# Altium schematic sheet LORA_Sheet1.SchDoc
size A4; SheetNumber: 5; SheetTotal: 11
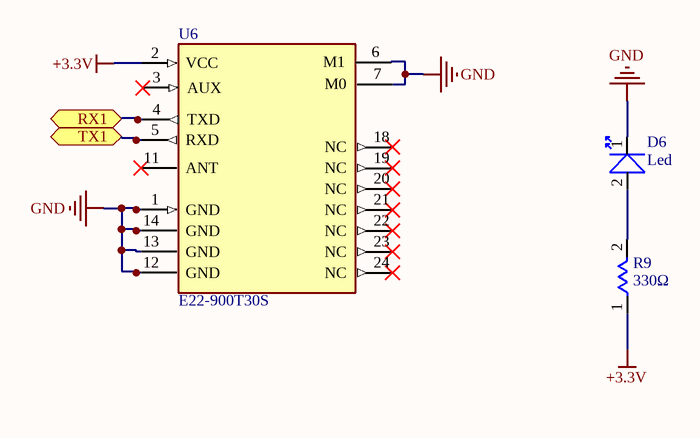
[diagram p0: LORA_Sheet1.SchDoc]

## Parts
D6  Led  [LED - 0603]
R9  330Ω  [RES - 0603]
U6  E22-900T30S  [E220-400T30S]

## Ports
RX1 (bidir), TX1 (bidir)

## Nets
+3.3V: R9.1 U6.2(VCC)
GND: D6.1 U6.1(GND) U6.6(M1) U6.7(M0) U6.12(GND) U6.13(GND) U6.14(GND)
RX1: U6.4(TXD) ; port RX1
TX1: U6.5(RXD) ; port TX1
NetD6_2: D6.2 R9.2

Not connected (* = marked no-connect by the designer): U6 3(AUX)* 11(ANT)* 18(NC)* 19(NC)* 20(NC)* 21(NC)* 22(NC)* 23(NC)* 24(NC)*

## Library data of the parts
D6 = Led: HL-PST-1608U51GC - LED SMD 0603 GREEN 500mcd 120° WATER CLEAR; ComponentLink1Description: Satın Alma Linki; ComponentLink1URL: https://ozdisan.com/Product/Detail/471660/HL-PST-1608U51GC; ComponentLink2Description: Datasheet; ComponentLink2URL: https://cdn.ozdisan.com/ETicaret_Dosya/471660_7204356.pdf
R9 = Res: SMD Res; ComponentLink1Description: Datasheet; ComponentLink1URL: https://cdn.ozdisan.com/ETicaret_Dosya/570122_9878629.pdf; ComponentLink2Description: Satın Alma Linki; ComponentLink2URL: https://www.ozdisan.com/pasif-komponentler/direncler/smt-smd-direncler/TC0325B3301T5C; ComponentLink3Description: Satın Alma Linki; ComponentLink3URL: https://ozdisan.com/pasif-komponentler/direncler/smt-smd-ve-cip-direncler/0603SAF4701T5E; ComponentLink4Description: Satın Alma Linki; ComponentLink4URL: https://ozdisan.com/pasif-komponentler/direncler/smt-smd-ve-cip-direncler/0805S8F604JT5E; ComponentLink5Description: Satın Alma Linki; ComponentLink5URL: https://ozdisan.com/pasif-komponentler/direncler/smt-smd-ve-cip-direncler/0603SAF1022T5E; ComponentLink6Description: Satın Alma Linki; ComponentLink6URL: https://www.ozdisan.com/pasif-komponentler/direncler/smt-smd-direncler/CQ03SAF0000T5E
U6 = E22-900T30S: E22-900T30S is a wireless serial port module _UART_ based on SEMTECH's SX1262 RF chip.; MF: EBYTE; MP: E22-900T30S; Package: Package Analog Devices; Price: None; Value: *; SnapEDA_Link: https://www.snapeda.com/parts/E22-900T30S/EBYTE/view-part/3611926/?ref=snap; Availability: Unavailable; ComponentLink1Description: Satın Alma L,nk,; ComponentLink1URL: https://www.f1depo.com/urun/ebyte-e220-400t30s-433-mhz-30dbm-lora-modul-10km; ComponentLink2Description: Datasheet; ComponentLink2URL: https://www.google.com/search?q=EBYTE+E220-400T30S+433+Mhz+30dbm+Lora+Mod%C3%BCl+datasheet&oq=EBYTE+E220-400T30S+433+Mhz+30dbm+Lora+Mod%C3%BCl+datasheet&aqs=chrome..69i57j33i10i21.2976j0j7&sourceid=chrome&ie=UTF-8